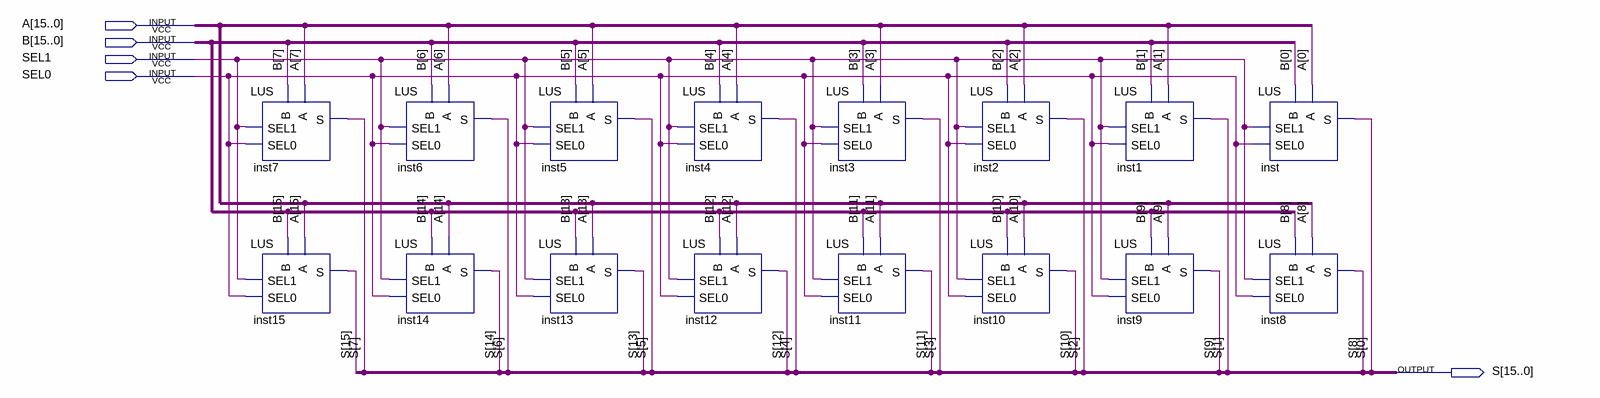
[diagram p0: schematic sheet]
// Quartus schematic LU.bdf as structural Verilog: 16 symbols, 5 pins
module LU (
  input  [15:0] A,
  input  [15:0] B,
  input  SEL1,
  input  SEL0,
  output [15:0] S
);

  LUS inst7 (.SEL1(SEL1), .SEL0(SEL0), .A(A[7]), .B(B[7]), .S(S[7]));
  LUS inst15 (.SEL1(SEL1), .SEL0(SEL0), .A(A[15]), .B(B[15]), .S(S[15]));
  LUS inst6 (.SEL1(SEL1), .SEL0(SEL0), .A(A[6]), .B(B[6]), .S(S[6]));
  LUS inst14 (.SEL1(SEL1), .SEL0(SEL0), .A(A[14]), .B(B[14]), .S(S[14]));
  LUS inst5 (.SEL1(SEL1), .SEL0(SEL0), .A(A[5]), .B(B[5]), .S(S[5]));
  LUS inst13 (.SEL1(SEL1), .SEL0(SEL0), .A(A[13]), .B(B[13]), .S(S[13]));
  LUS inst4 (.SEL1(SEL1), .SEL0(SEL0), .A(A[4]), .B(B[4]), .S(S[4]));
  LUS inst12 (.SEL1(SEL1), .SEL0(SEL0), .A(A[12]), .B(B[12]), .S(S[12]));
  LUS inst3 (.SEL1(SEL1), .SEL0(SEL0), .A(A[3]), .B(B[3]), .S(S[3]));
  LUS inst11 (.SEL1(SEL1), .SEL0(SEL0), .A(A[11]), .B(B[11]), .S(S[11]));
  LUS inst2 (.SEL1(SEL1), .SEL0(SEL0), .A(A[2]), .B(B[2]), .S(S[2]));
  LUS inst10 (.SEL1(SEL1), .SEL0(SEL0), .A(A[10]), .B(B[10]), .S(S[10]));
  LUS inst1 (.SEL1(SEL1), .SEL0(SEL0), .A(A[1]), .B(B[1]), .S(S[1]));
  LUS inst9 (.SEL1(SEL1), .SEL0(SEL0), .A(A[9]), .B(B[9]), .S(S[9]));
  LUS inst (.SEL1(SEL1), .SEL0(SEL0), .A(A[0]), .B(B[0]), .S(S[0]));
  LUS inst8 (.SEL1(SEL1), .SEL0(SEL0), .A(A[8]), .B(B[8]), .S(S[8]));
endmodule
